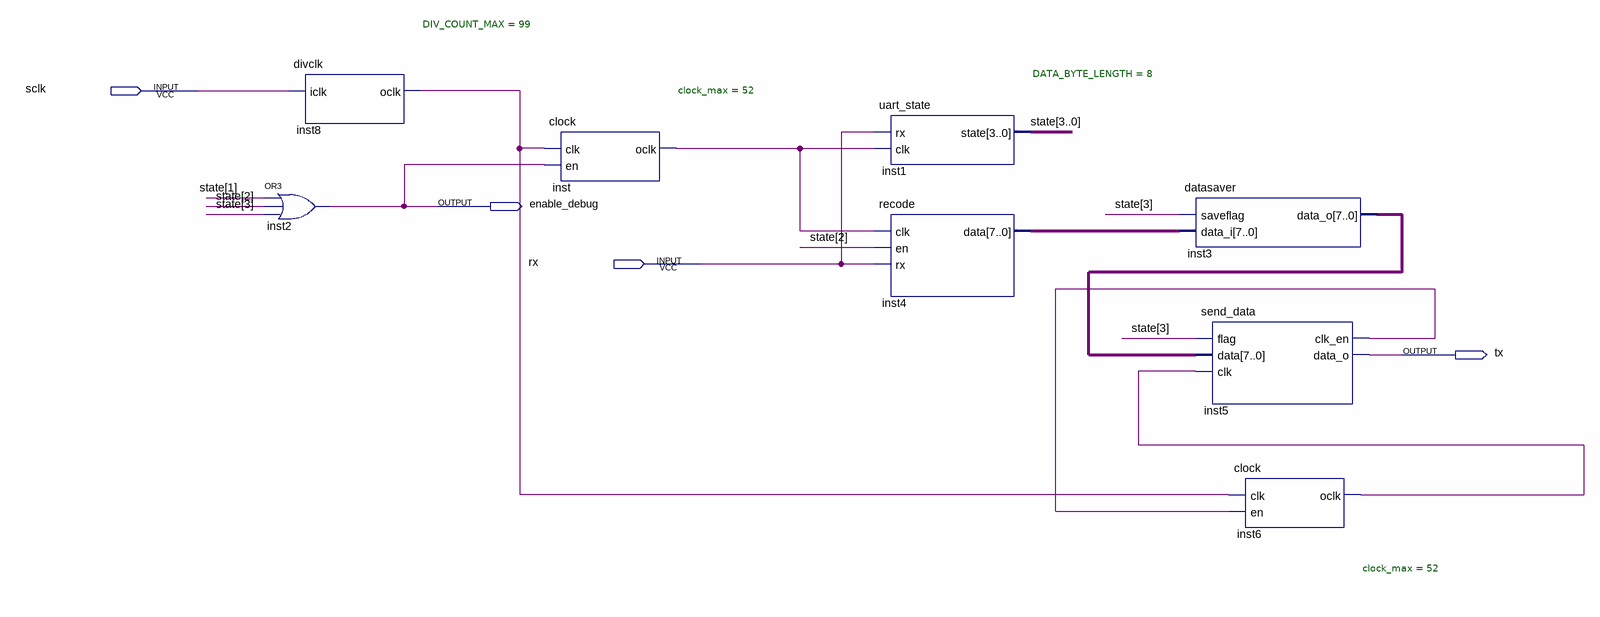
[diagram p0: schematic sheet]
// Quartus schematic uart.bdf as structural Verilog: 8 symbols, 4 pins
module uart (
  input  sclk,
  input  rx,
  output enable_debug,
  output tx
);

  wire inst5_clk_en, inst6_oclk, inst8_oclk, inst_oclk;
  wire [3:0] state;
  wire [7:0] inst3_data_o, inst4_data;

  divclk #(.DIV_COUNT_MAX(99)) inst8 (.iclk(sclk), .oclk(inst8_oclk));
  or inst2 (enable_debug, state[1], state[2], state[3]);
  clock #(.clock_max(52)) inst (.clk(inst8_oclk), .en(enable_debug), .oclk(inst_oclk));
  uart_state #(.DATA_BYTE_LENGTH(8)) inst1 (.rx(rx), .clk(inst_oclk), .state(state));
  recode inst4 (.clk(inst_oclk), .en(state[2]), .rx(rx), .data(inst4_data));
  datasaver inst3 (.saveflag(state[3]), .data_i(inst4_data), .data_o(inst3_data_o));
  send_data inst5 (.flag(state[3]), .data(inst3_data_o), .clk(inst6_oclk), .clk_en(inst5_clk_en), .data_o(tx));
  clock #(.clock_max(52)) inst6 (.clk(inst8_oclk), .en(inst5_clk_en), .oclk(inst6_oclk));
endmodule
